# EAGLE schematic RoombaCatStalker (EAGLE 6.1)
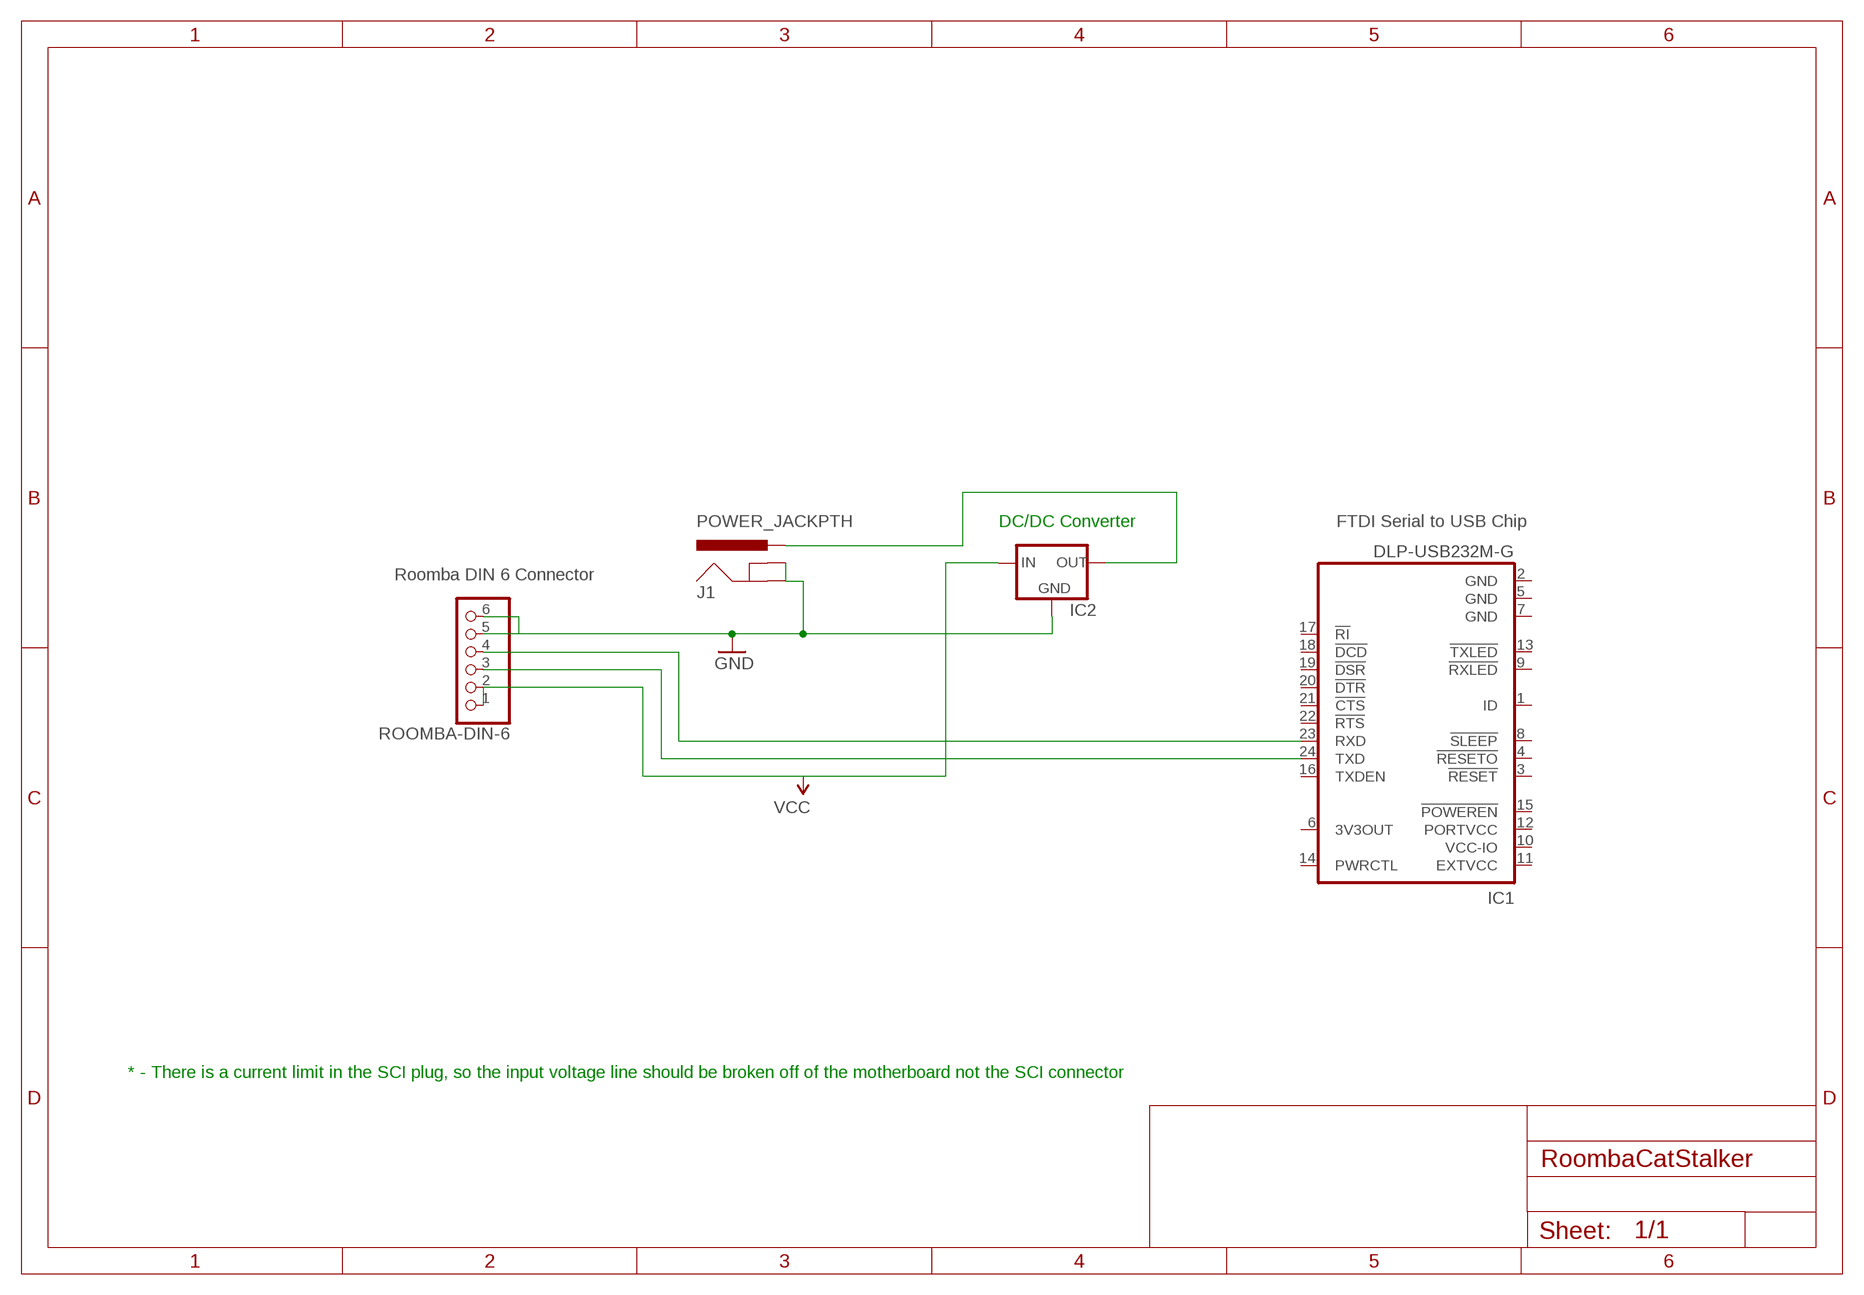
[diagram p0: schematic, sheet 1]

## Parts
IC1  DLP-USB232M-G  [DLP-USB232M]
IC2  XC63FPL  [TO92]
J1  POWER_JACKPTH  [POWER_JACK_PTH]
ROOMBA-DIN-6  PINHD-1X6  [1X06]

## Nets
GND: IC2.2(GND) J1.GND J1.GNDBREAK ROOMBA-DIN-6.5 ROOMBA-DIN-6.6
N$1: IC1.24(TXD) ROOMBA-DIN-6.3
N$2: IC1.23(RXD) ROOMBA-DIN-6.4
N$6: IC2.3(OUT) J1.PWR
VCC: IC2.1(IN) ROOMBA-DIN-6.1 ROOMBA-DIN-6.2
Unconnected: IC1.1(ID) IC1.2(GND) IC1.3(!RESET) IC1.4(!RESETO) IC1.5(GND) IC1.6(3V3OUT) IC1.7(GND) IC1.8(!SLEEP) IC1.9(!RXLED) IC1.10(VCC-IO) IC1.11(EXTVCC) IC1.12(PORTVCC) IC1.13(!TXLED) IC1.14(PWRCTL) IC1.15(!POWEREN) IC1.16(TXDEN) IC1.17(!RI) IC1.18(!DCD) IC1.19(!DSR) IC1.20(!DTR) IC1.21(!CTS) IC1.22(!RTS)

## Notes on the sheet
- DC/DC Converter | FTDI Serial to USB Chip
- Roomba DIN 6 Connector
- * - There is a current limit in the SCI plug, so the input voltage line should be broken off of the motherboard not the SCI connector

## Library data of the parts
IC1 = ftdichip:DLP-USB232M-G: DLP-USB232M-G USB - SERIAL UART Interface Module Source: http://www.ftdichip.com/Documents/DataSheets/DLP/dlp-usb232m15.pdf; OC_FARNELL: unknown; OC_NEWARK: unknown
IC2 = v-reg:XC63FP: Positiv Voltage Regulators www.torex.co.jp/english/product/pro02/pdf/0201_xc62fp.pdf
J1 = spk1:POWER_JACK: Power Jack This is the standard 5.5mm barrel jack for power. The PTH is the most common, proven, reliable, footprint. All others are experimental. The Slot footprint only works if the mill layer is transmitted to the PCB fab house so be warned. Spark Fun Electronics SKU : PRT-00119. Mating wall wart : TOL-00298 (and others)
ROOMBA-DIN-6 = adafruit:PINHD-1X6: PIN HEADER